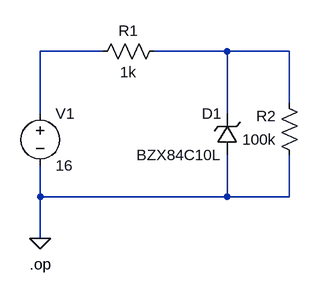
[diagram p0: schematic Draft2.asc]
Draft2.asc, the LTspice schematic file:
Version 4.1
SHEET 1 880 680
WIRE 80 0 -16 0
WIRE 272 0 160 0
WIRE 368 0 272 0
WIRE 368 80 368 0
WIRE -16 96 -16 0
WIRE 272 96 272 0
WIRE -16 224 -16 176
WIRE 272 224 272 160
WIRE 272 224 -16 224
WIRE 368 224 368 160
WIRE 368 224 272 224
WIRE -16 288 -16 224
FLAG -16 288 0
DATAFLAG 0 0 ""
DATAFLAG 320 0 ""
SYMBOL zener 288 160 R180
WINDOW 0 24 64 Left 2
WINDOW 3 24 0 Left 2
SYMATTR InstName D1
SYMATTR Value BZX84C10L
SYMBOL res 176 -16 R90
WINDOW 0 0 56 VBottom 2
WINDOW 3 32 56 VTop 2
SYMATTR InstName R1
SYMATTR Value 1k
SYMBOL res 384 176 R180
WINDOW 0 36 76 Left 2
WINDOW 3 36 40 Left 2
SYMATTR InstName R2
SYMATTR Value 100k
SYMBOL voltage -16 80 R0
SYMATTR InstName V1
SYMATTR Value 16
TEXT -32 328 Left 2 !.op

The netlist it stands for:
* Draft2.asc
D1 0 N002 BZX84C10L
R1 N002 N001 1k
R2 0 N002 100k
V1 N001 0 16
.model D D
.lib standard.dio
.op
.backanno
.end